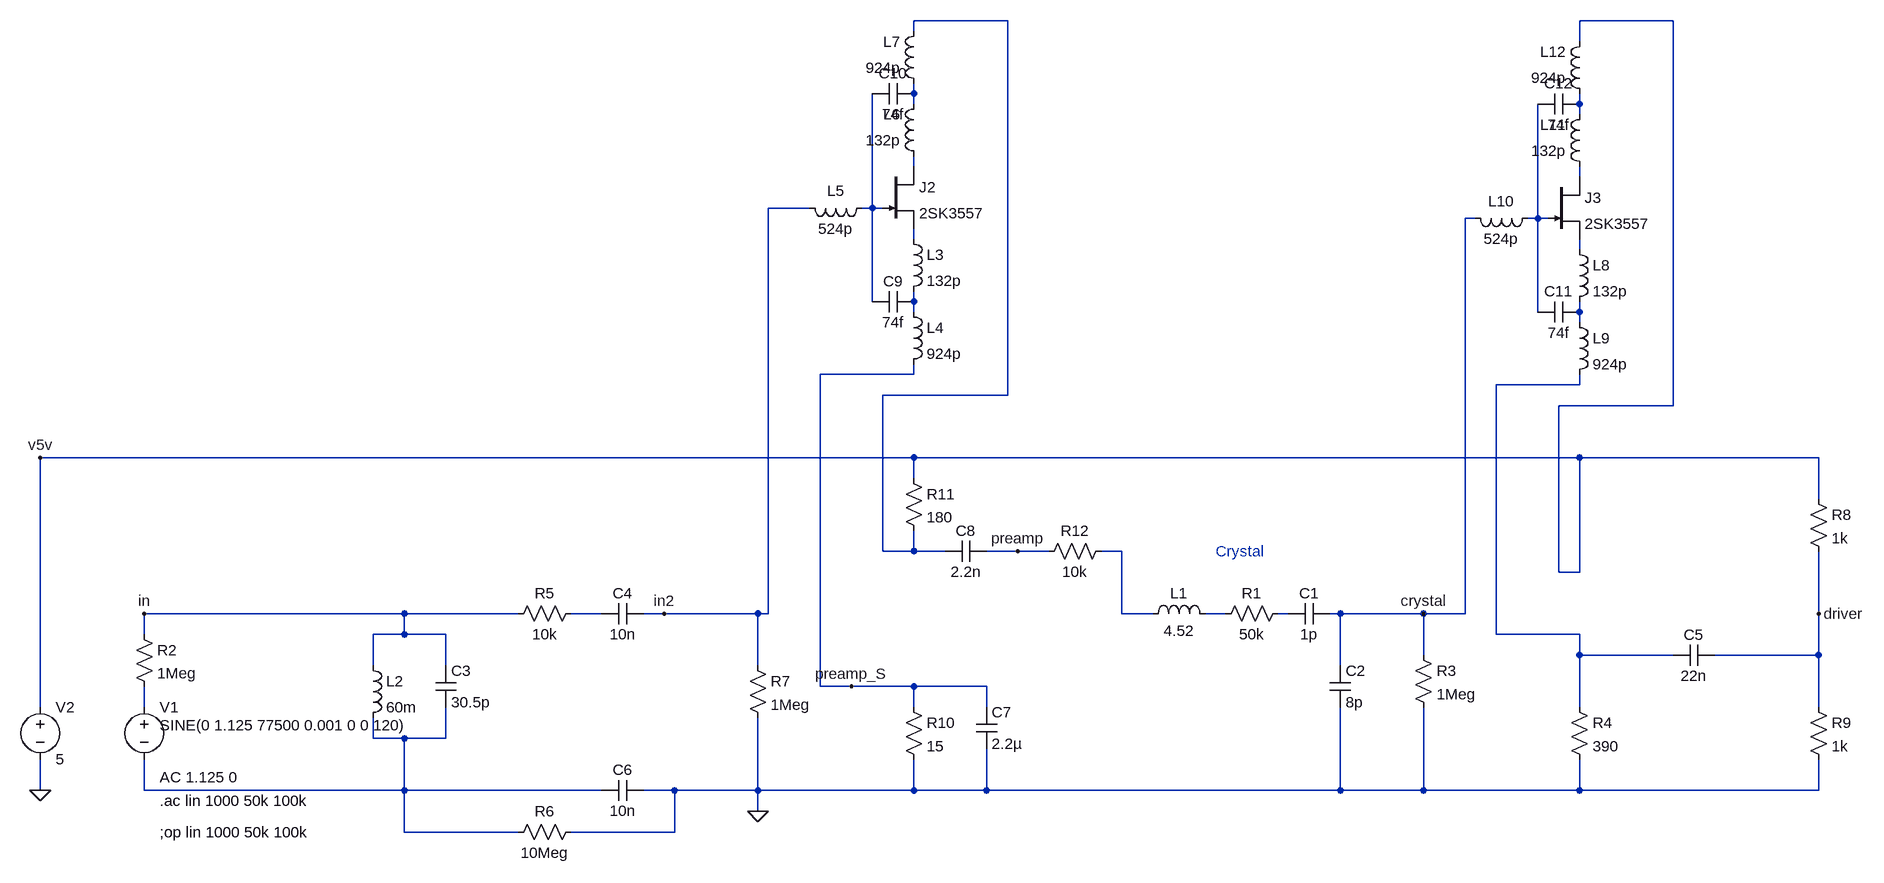
[diagram p0: schematic 04_nFET_and_Crystal_and_nFET__FET-fine-model_AC-analysis.asc]
04_nFET_and_Crystal_and_nFET__FET-fine-model_AC-analysis.asc, the LTspice schematic file:
Version 4
SHEET 1 1192 680
WIRE -176 -896 -320 -896
WIRE 848 -896 704 -896
WIRE -320 -880 -320 -896
WIRE 704 -864 704 -896
WIRE -320 -784 -320 -800
WIRE -320 -768 -320 -784
WIRE 704 -768 704 -784
WIRE 704 -752 704 -768
WIRE -320 -672 -320 -688
WIRE 704 -656 704 -672
WIRE -480 -608 -544 -608
WIRE -384 -608 -384 -784
WIRE -384 -608 -400 -608
WIRE -368 -608 -384 -608
WIRE 544 -592 528 -592
WIRE 640 -592 640 -768
WIRE 640 -592 624 -592
WIRE 656 -592 640 -592
WIRE -320 -560 -320 -576
WIRE 704 -544 704 -560
WIRE -384 -464 -384 -608
WIRE -320 -464 -320 -480
WIRE -320 -448 -320 -464
WIRE 640 -448 640 -592
WIRE 704 -448 704 -464
WIRE 704 -432 704 -448
WIRE -320 -352 -320 -368
WIRE -320 -352 -464 -352
WIRE 704 -336 704 -352
WIRE 704 -336 576 -336
WIRE -176 -320 -176 -896
WIRE -176 -320 -368 -320
WIRE 848 -304 848 -896
WIRE 848 -304 672 -304
WIRE -320 -224 -1664 -224
WIRE 704 -224 -320 -224
WIRE 1072 -224 704 -224
WIRE -320 -192 -320 -224
WIRE 1072 -160 1072 -224
WIRE -368 -80 -368 -320
WIRE -320 -80 -320 -112
WIRE -320 -80 -368 -80
WIRE -272 -80 -320 -80
WIRE -160 -80 -208 -80
WIRE -112 -80 -160 -80
WIRE 0 -80 -32 -80
WIRE 672 -48 672 -304
WIRE 704 -48 704 -224
WIRE 704 -48 672 -48
WIRE -1104 16 -1504 16
WIRE -928 16 -1104 16
WIRE -800 16 -848 16
WIRE -704 16 -736 16
WIRE -560 16 -704 16
WIRE -544 16 -544 -608
WIRE -544 16 -560 16
WIRE 0 16 0 -80
WIRE 48 16 0 16
WIRE 160 16 128 16
WIRE 256 16 240 16
WIRE 336 16 320 16
WIRE 464 16 336 16
WIRE 528 16 528 -592
WIRE 528 16 464 16
WIRE 1072 16 1072 -80
WIRE -1504 48 -1504 16
WIRE -1104 48 -1104 16
WIRE -1104 48 -1152 48
WIRE -1040 48 -1104 48
WIRE 576 48 576 -336
WIRE 704 48 576 48
WIRE 464 80 464 16
WIRE 704 80 704 48
WIRE 848 80 704 80
WIRE 1072 80 1072 16
WIRE 1072 80 912 80
WIRE -1152 96 -1152 48
WIRE -1040 96 -1040 48
WIRE -560 96 -560 16
WIRE 336 96 336 16
WIRE -464 128 -464 -352
WIRE -416 128 -464 128
WIRE -320 128 -416 128
WIRE -208 128 -320 128
WIRE -1664 160 -1664 -224
WIRE -1504 160 -1504 128
WIRE -320 160 -320 128
WIRE -208 160 -208 128
WIRE 704 160 704 80
WIRE 1072 160 1072 80
WIRE -1152 208 -1152 176
WIRE -1104 208 -1152 208
WIRE -1040 208 -1040 160
WIRE -1040 208 -1104 208
WIRE -1664 288 -1664 240
WIRE -1504 288 -1504 240
WIRE -1104 288 -1104 208
WIRE -1104 288 -1504 288
WIRE -800 288 -1104 288
WIRE -688 288 -736 288
WIRE -560 288 -560 176
WIRE -560 288 -688 288
WIRE -320 288 -320 240
WIRE -320 288 -560 288
WIRE -208 288 -208 224
WIRE -208 288 -320 288
WIRE 336 288 336 160
WIRE 336 288 -208 288
WIRE 464 288 464 160
WIRE 464 288 336 288
WIRE 704 288 704 240
WIRE 704 288 464 288
WIRE 1072 288 1072 240
WIRE 1072 288 704 288
WIRE -560 320 -560 288
WIRE -1104 352 -1104 288
WIRE -928 352 -1104 352
WIRE -688 352 -688 288
WIRE -688 352 -848 352
FLAG 464 16 crystal
FLAG -1504 16 in
FLAG -1664 288 0
FLAG -1664 -224 v5v
FLAG 1072 16 driver
FLAG -560 320 0
FLAG -704 16 in2
FLAG -160 -80 preamp
FLAG -416 128 preamp_S
SYMBOL ind 32 32 R270
WINDOW 0 32 56 VTop 2
WINDOW 3 5 56 VBottom 2
SYMATTR InstName L1
SYMATTR Value 4.52
SYMBOL cap 320 0 R90
WINDOW 0 0 32 VBottom 2
WINDOW 3 32 32 VTop 2
SYMATTR InstName C1
SYMATTR Value 1p
SYMBOL res 256 0 R90
WINDOW 0 0 56 VBottom 2
WINDOW 3 32 56 VTop 2
SYMATTR InstName R1
SYMATTR Value 50k
SYMBOL voltage -1504 144 R0
WINDOW 123 24 124 Left 2
WINDOW 39 0 0 Left 0
WINDOW 3 24 44 Left 2
SYMATTR Value2 AC 1.125 0
SYMATTR InstName V1
SYMATTR Value SINE(0 1.125 77500 0.001 0 0 120)
SYMBOL res -1520 32 R0
SYMATTR InstName R2
SYMATTR Value 1Meg
SYMBOL res 448 64 R0
SYMATTR InstName R3
SYMATTR Value 1Meg
SYMBOL cap 320 96 R0
SYMATTR InstName C2
SYMATTR Value 8p
SYMBOL res 688 144 R0
SYMATTR InstName R4
SYMATTR Value 390
SYMBOL voltage -1664 144 R0
WINDOW 123 0 0 Left 0
WINDOW 39 24 124 Left 2
SYMATTR InstName V2
SYMATTR Value 5
SYMBOL cap 912 64 R90
WINDOW 0 0 32 VBottom 2
WINDOW 3 32 32 VTop 2
SYMATTR InstName C5
SYMATTR Value 22n
SYMBOL res 1056 -176 R0
SYMATTR InstName R8
SYMATTR Value 1k
SYMBOL res 1056 144 R0
SYMATTR InstName R9
SYMATTR Value 1k
SYMBOL ind -1168 80 R0
SYMATTR InstName L2
SYMATTR Value 60m
SYMBOL cap -1056 96 R0
SYMATTR InstName C3
SYMATTR Value 30.5p
SYMBOL res -832 0 R90
WINDOW 0 0 56 VBottom 2
WINDOW 3 32 56 VTop 2
SYMATTR InstName R5
SYMATTR Value 10k
SYMBOL cap -736 0 R90
WINDOW 0 0 32 VBottom 2
WINDOW 3 32 32 VTop 2
SYMATTR InstName C4
SYMATTR Value 10n
SYMBOL cap -736 272 R90
WINDOW 0 0 32 VBottom 2
WINDOW 3 32 32 VTop 2
SYMATTR InstName C6
SYMATTR Value 10n
SYMBOL res -832 336 R90
WINDOW 0 0 56 VBottom 2
WINDOW 3 32 56 VTop 2
SYMATTR InstName R6
SYMATTR Value 10Meg
SYMBOL res -576 80 R0
SYMATTR InstName R7
SYMATTR Value 1Meg
SYMBOL res -336 144 R0
SYMATTR InstName R10
SYMATTR Value 15
SYMBOL cap -224 160 R0
SYMATTR InstName C7
SYMATTR Value 2.2µ
SYMBOL njf -368 -672 R0
SYMATTR InstName J2
SYMATTR Value 2SK3557
SYMBOL res -336 -208 R0
SYMATTR InstName R11
SYMATTR Value 180
SYMBOL cap -208 -96 R90
WINDOW 0 0 32 VBottom 2
WINDOW 3 32 32 VTop 2
SYMATTR InstName C8
SYMATTR Value 2.2n
SYMBOL res -16 -96 R90
WINDOW 0 0 56 VBottom 2
WINDOW 3 32 56 VTop 2
SYMATTR InstName R12
SYMATTR Value 10k
SYMBOL ind -336 -576 R0
SYMATTR InstName L3
SYMATTR Value 132p
SYMBOL ind -336 -464 R0
SYMATTR InstName L4
SYMATTR Value 924p
SYMBOL ind -384 -624 R90
WINDOW 0 5 56 VBottom 2
WINDOW 3 32 56 VTop 2
SYMATTR InstName L5
SYMATTR Value 524p
SYMBOL ind -304 -672 R180
WINDOW 0 36 80 Left 2
WINDOW 3 36 40 Left 2
SYMATTR InstName L6
SYMATTR Value 132p
SYMBOL ind -304 -784 R180
WINDOW 0 36 80 Left 2
WINDOW 3 36 40 Left 2
SYMATTR InstName L7
SYMATTR Value 924p
SYMBOL cap -320 -480 R90
WINDOW 0 0 32 VBottom 2
WINDOW 3 32 32 VTop 2
SYMATTR InstName C9
SYMATTR Value 74f
SYMBOL cap -320 -800 R90
WINDOW 0 0 32 VBottom 2
WINDOW 3 32 32 VTop 2
SYMATTR InstName C10
SYMATTR Value 74f
SYMBOL njf 656 -656 R0
SYMATTR InstName J3
SYMATTR Value 2SK3557
SYMBOL ind 688 -560 R0
SYMATTR InstName L8
SYMATTR Value 132p
SYMBOL ind 688 -448 R0
SYMATTR InstName L9
SYMATTR Value 924p
SYMBOL ind 640 -608 R90
WINDOW 0 5 56 VBottom 2
WINDOW 3 32 56 VTop 2
SYMATTR InstName L10
SYMATTR Value 524p
SYMBOL ind 720 -656 R180
WINDOW 0 36 80 Left 2
WINDOW 3 36 40 Left 2
SYMATTR InstName L11
SYMATTR Value 132p
SYMBOL ind 720 -768 R180
WINDOW 0 36 80 Left 2
WINDOW 3 36 40 Left 2
SYMATTR InstName L12
SYMATTR Value 924p
SYMBOL cap 704 -464 R90
WINDOW 0 0 32 VBottom 2
WINDOW 3 32 32 VTop 2
SYMATTR InstName C11
SYMATTR Value 74f
SYMBOL cap 704 -784 R90
WINDOW 0 0 32 VBottom 2
WINDOW 3 32 32 VTop 2
SYMATTR InstName C12
SYMATTR Value 74f
TEXT -1480 304 Left 2 !.ac lin 1000 50k 100k
TEXT 144 -80 Left 2 ;Crystal
TEXT -1480 352 Left 2 !;op lin 1000 50k 100k

The netlist it stands for:
* 04_nFET_and_Crystal_and_nFET__FET-fine-model_AC-analysis.asc
L1 N013 N015 4.52
C1 crystal N016 1p
R1 N016 N015 50k
V1 N017 N018 SINE(0 1.125 77500 0.001 0 0 120) AC 1.125 0
R2 in N017 1Meg
R3 crystal 0 1Meg
C2 crystal 0 8p
R4 N012 0 390
V2 v5v 0 5
C5 driver N012 22n
R8 v5v driver 1k
R9 driver 0 1k
L2 in N018 60m
C3 in N018 30.5p
R5 N014 in 10k
C4 in2 N014 10n
C6 0 N018 10n
R6 0 N018 10Meg
R7 in2 0 1Meg
R10 preamp_S 0 15
C7 preamp_S 0 2.2µ
J2 N004 N006 N008 2SK3557
R11 v5v N001 180
C8 preamp N001 2.2n
R12 N013 preamp 10k
L3 N008 N010 132p
L4 N010 preamp_S 924p
L5 N006 in2 524p
L6 N004 N002 132p
L7 N002 N001 924p
C9 N010 N006 74f
C10 N002 N006 74f
J3 N005 N007 N009 2SK3557
L8 N009 N011 132p
L9 N011 N012 924p
L10 N007 crystal 524p
L11 N005 N003 132p
L12 N003 v5v 924p
C11 N011 N007 74f
C12 N003 N007 74f
.model NJF NJF
.model PJF PJF
.lib standard.jft
.ac lin 1000 50k 100k
* Crystal
;op lin 1000 50k 100k
.backanno
.end